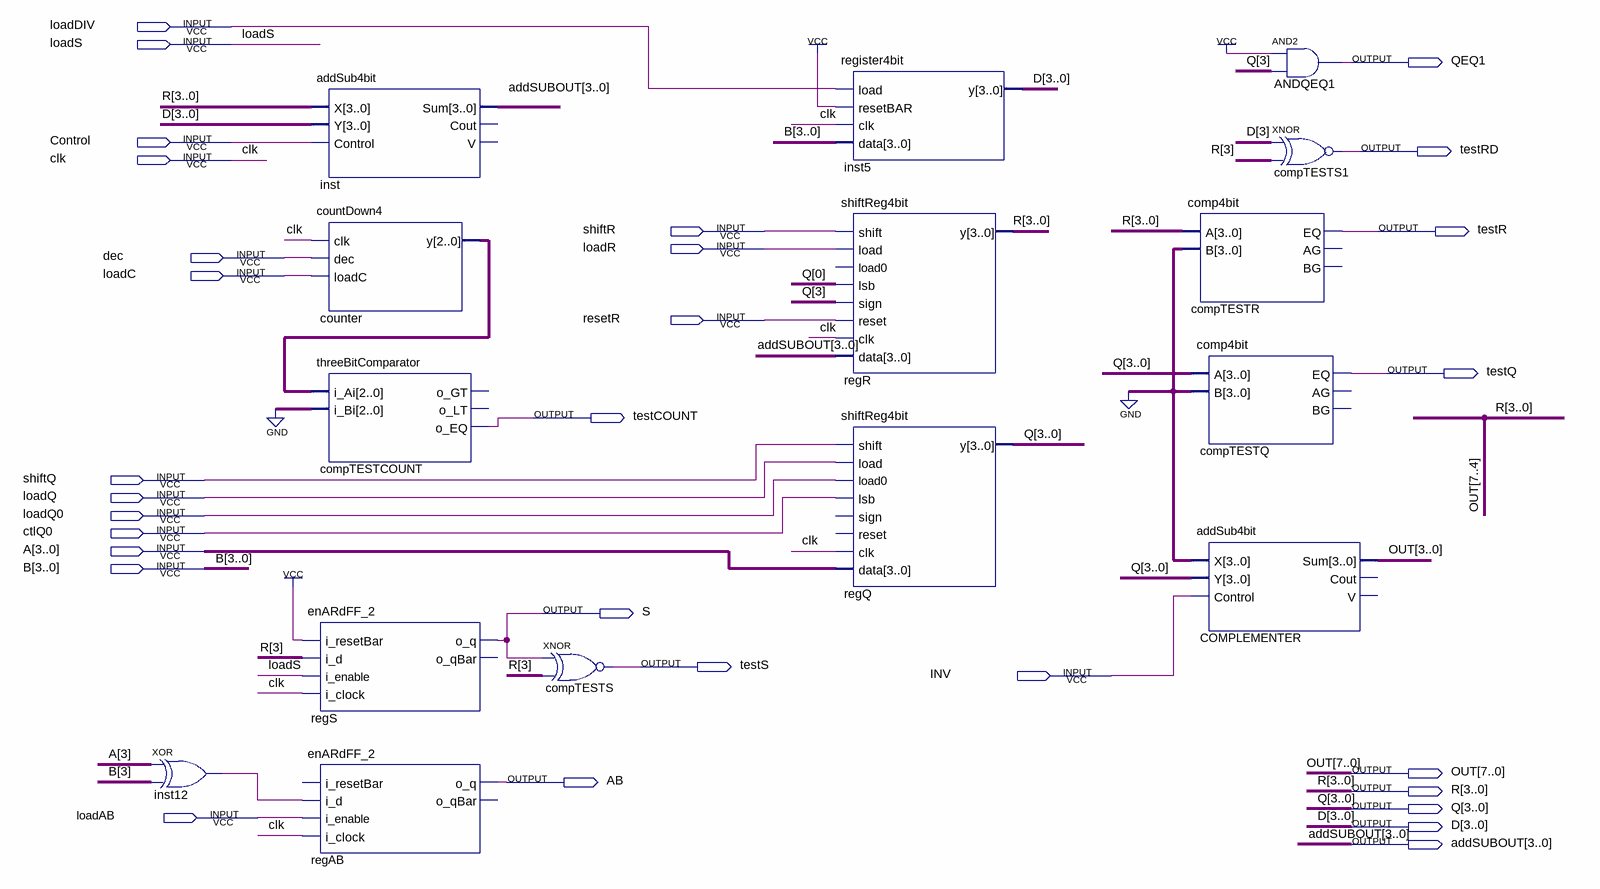
[diagram p0: schematic sheet]
// Quartus schematic datapath.bdf as structural Verilog: 15 symbols, 30 pins
module datapath (
  input  loadDIV,
  input  loadS,
  input  Control,
  input  clk,
  input  shiftR,
  input  loadR,
  input  dec,
  input  loadC,
  input  resetR,
  input  shiftQ,
  input  loadQ,
  input  loadQ0,
  input  ctlQ0,
  input  [3:0] A,
  input  [3:0] B,
  input  INV,
  input  loadAB,
  output QEQ1,
  output testRD,
  output testR,
  output testQ,
  output testCOUNT,
  output S,
  output testS,
  output [7:0] OUT,
  output AB,
  output [3:0] R,
  output [3:0] Q,
  output [3:0] D,
  output [3:0] addSUBOUT
);

  wire inst12_out;
  wire [2:0] counter_y;

  xor inst12 (inst12_out, A[3], B[3]);
  enARdFF_2 regS (.i_resetBar(1'b1), .i_d(R[3]), .i_enable(loadS), .i_clock(clk), .o_q(S));  // open: o_qBar
  enARdFF_2 regAB (.i_d(inst12_out), .i_enable(loadAB), .i_clock(clk), .o_q(AB));  // open: i_resetBar, o_qBar
  addSub4bit inst (.X(R), .Y(D), .Control(Control), .Sum(addSUBOUT));  // open: Cout, V
  countDown4 counter (.clk(clk), .dec(dec), .loadC(loadC), .y(counter_y));
  threeBitComparator compTESTCOUNT (.i_Ai(counter_y), .i_Bi(3'b000), .o_EQ(testCOUNT));  // open: o_GT, o_LT
  xnor compTESTS (testS, S, R[3]);
  register4bit inst5 (.load(loadDIV), .resetBAR(1'b1), .clk(clk), .data(B), .y(D));
  shiftReg4bit regR (
    .shift(shiftR), .load(loadR), .lsb(Q[0]), .sign(Q[3]), .reset(resetR), .clk(clk), .data(addSUBOUT), .y(R));  // open: load0
  shiftReg4bit regQ (
    .shift(shiftQ), .load(loadQ), .load0(loadQ0), .lsb(ctlQ0), .clk(clk), .data(A), .y(Q));  // open: sign, reset
  comp4bit compTESTR (.A(R), .B(4'b0000), .EQ(testR));  // open: AG, BG
  comp4bit compTESTQ (.A(Q), .B(4'b0000), .EQ(testQ));  // open: AG, BG
  addSub4bit COMPLEMENTER (.X(4'b0000), .Y(Q), .Control(INV), .Sum(OUT[3:0]));  // open: Cout, V
  and ANDQEQ1 (QEQ1, 1'b1, Q[3]);
  xnor compTESTS1 (testRD, D[3], R[3]);
endmodule
